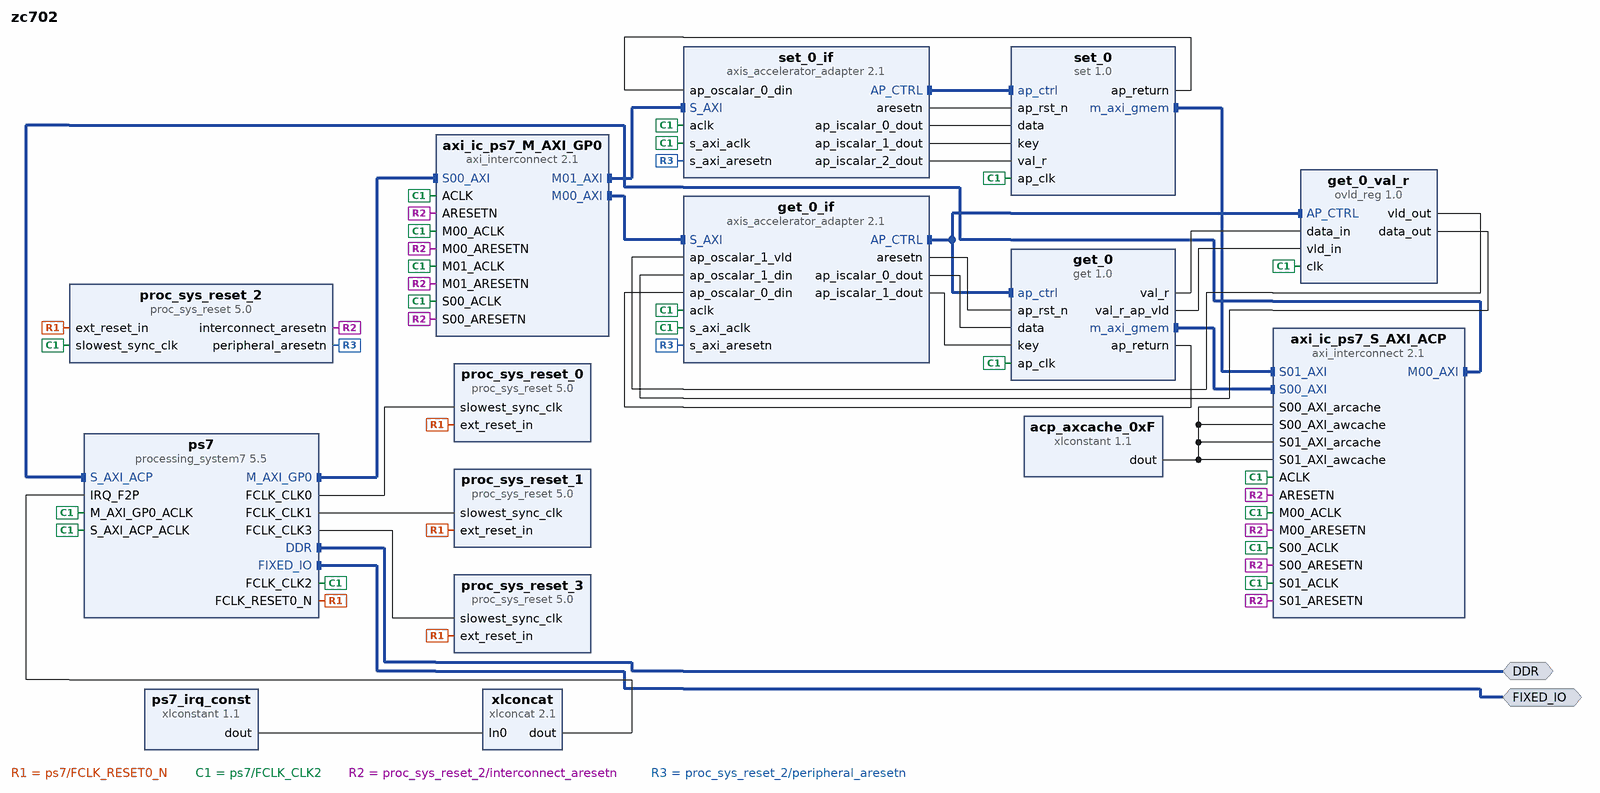
[diagram p0: block diagram of the top level]
# Vivado block design zc702, Vivado 2015.4
create_bd_design zc702

create_bd_intf_port -mode Master -vlnv xilinx.com:interface:ddrx_rtl:1.0 DDR
create_bd_intf_port -mode Master -vlnv xilinx.com:display_processing_system7:fixedio_rtl:1.0 FIXED_IO

create_bd_cell -type ip -vlnv xilinx.com:ip:proc_sys_reset:5.0 proc_sys_reset_1
set_property -dict {CONFIG.C_AUX_RESET_HIGH 0} [get_bd_cells proc_sys_reset_1]
create_bd_cell -type ip -vlnv xilinx.com:ip:proc_sys_reset:5.0 proc_sys_reset_2
set_property -dict {CONFIG.C_AUX_RESET_HIGH 0} [get_bd_cells proc_sys_reset_2]
create_bd_cell -type ip -vlnv xilinx.com:ip:proc_sys_reset:5.0 proc_sys_reset_3
set_property -dict {CONFIG.C_AUX_RESET_HIGH 0} [get_bd_cells proc_sys_reset_3]
create_bd_cell -type ip -vlnv xilinx.com:ip:proc_sys_reset:5.0 proc_sys_reset_0
set_property -dict {CONFIG.C_AUX_RESET_HIGH 0} [get_bd_cells proc_sys_reset_0]
create_bd_cell -type ip -vlnv xilinx.com:ip:processing_system7:5.5 ps7
set_property -dict [list \
  CONFIG.PCW_FCLK_CLK1_BUF true \
  CONFIG.PCW_FCLK_CLK2_BUF true \
  CONFIG.PCW_FCLK_CLK3_BUF true \
  CONFIG.PCW_UIPARAM_DDR_FREQ_MHZ 533.333333 \
  CONFIG.PCW_APU_PERIPHERAL_FREQMHZ 666.666666 \
  CONFIG.PCW_SDIO_PERIPHERAL_FREQMHZ 50 \
  CONFIG.PCW_UART_PERIPHERAL_FREQMHZ 50 \
  CONFIG.PCW_CAN_PERIPHERAL_FREQMHZ 23.8095 \
  CONFIG.PCW_I2C_PERIPHERAL_FREQMHZ 111.111115 \
  CONFIG.PCW_FPGA0_PERIPHERAL_FREQMHZ 166 \
  CONFIG.PCW_FPGA1_PERIPHERAL_FREQMHZ 142 \
  CONFIG.PCW_FPGA2_PERIPHERAL_FREQMHZ 100 \
  CONFIG.PCW_FPGA3_PERIPHERAL_FREQMHZ 200 \
  CONFIG.PCW_USE_S_AXI_ACP 1 \
  CONFIG.PCW_USE_FABRIC_INTERRUPT 1 \
  CONFIG.PCW_USE_DEFAULT_ACP_USER_VAL 1 \
  CONFIG.PCW_EN_CLK1_PORT 1 \
  CONFIG.PCW_EN_CLK2_PORT 1 \
  CONFIG.PCW_EN_CLK3_PORT 1 \
  CONFIG.PCW_IRQ_F2P_INTR 1 \
  CONFIG.PCW_PERIPHERAL_BOARD_PRESET part0 \
  CONFIG.PCW_PRESET_BANK0_VOLTAGE {LVCMOS 1.8V} \
  CONFIG.PCW_PRESET_BANK1_VOLTAGE {LVCMOS 1.8V} \
  CONFIG.PCW_UIPARAM_DDR_PARTNO {MT41J256M8 HX-15E} \
  CONFIG.PCW_QSPI_PERIPHERAL_ENABLE 1 \
  CONFIG.PCW_QSPI_QSPI_IO {MIO 1 .. 6} \
  CONFIG.PCW_QSPI_GRP_SINGLE_SS_ENABLE 1 \
  CONFIG.PCW_QSPI_GRP_SINGLE_SS_IO {MIO 1 .. 6} \
  CONFIG.PCW_QSPI_GRP_FBCLK_ENABLE 1 \
  CONFIG.PCW_QSPI_GRP_FBCLK_IO {MIO 8} \
  CONFIG.PCW_ENET0_PERIPHERAL_ENABLE 1 \
  CONFIG.PCW_ENET0_ENET0_IO {MIO 16 .. 27} \
  CONFIG.PCW_ENET0_GRP_MDIO_ENABLE 1 \
  CONFIG.PCW_ENET0_GRP_MDIO_IO {MIO 52 .. 53} \
  CONFIG.PCW_ENET0_RESET_ENABLE 1 \
  CONFIG.PCW_ENET0_RESET_IO {MIO 11} \
  CONFIG.PCW_SD0_PERIPHERAL_ENABLE 1 \
  CONFIG.PCW_SD0_SD0_IO {MIO 40 .. 45} \
  CONFIG.PCW_SD0_GRP_CD_ENABLE 1 \
  CONFIG.PCW_SD0_GRP_CD_IO {MIO 0} \
  CONFIG.PCW_SD0_GRP_WP_ENABLE 1 \
  CONFIG.PCW_SD0_GRP_WP_IO {MIO 15} \
  CONFIG.PCW_UART1_PERIPHERAL_ENABLE 1 \
  CONFIG.PCW_UART1_UART1_IO {MIO 48 .. 49} \
  CONFIG.PCW_CAN0_PERIPHERAL_ENABLE 1 \
  CONFIG.PCW_CAN0_CAN0_IO {MIO 46 .. 47} \
  CONFIG.PCW_USB0_PERIPHERAL_ENABLE 1 \
  CONFIG.PCW_USB0_USB0_IO {MIO 28 .. 39} \
  CONFIG.PCW_USB0_RESET_ENABLE 1 \
  CONFIG.PCW_USB0_RESET_IO {MIO 7} \
  CONFIG.PCW_I2C0_PERIPHERAL_ENABLE 1 \
  CONFIG.PCW_I2C0_I2C0_IO {MIO 50 .. 51} \
  CONFIG.PCW_I2C0_GRP_INT_ENABLE 0 \
  CONFIG.PCW_I2C0_RESET_ENABLE 1 \
  CONFIG.PCW_I2C0_RESET_IO {MIO 13} \
  CONFIG.PCW_GPIO_MIO_GPIO_ENABLE 1 \
  CONFIG.PCW_GPIO_MIO_GPIO_IO MIO \
  CONFIG.PCW_ENET0_PERIPHERAL_FREQMHZ {100 Mbps} \
  CONFIG.PCW_QSPI_PERIPHERAL_CLKSRC {ARM PLL} \
  CONFIG.PCW_TPIU_PERIPHERAL_CLKSRC {IO PLL} \
  CONFIG.PCW_DCI_PERIPHERAL_CLKSRC 1 \
  CONFIG.PCW_PCAP_PERIPHERAL_CLKSRC 1 \
  CONFIG.PCW_FPGA_FCLK1_ENABLE 1 \
  CONFIG.PCW_FPGA_FCLK2_ENABLE 1 \
  CONFIG.PCW_FPGA_FCLK3_ENABLE 1 \
] [get_bd_cells ps7]
# 353 more settings of ps7 are not shown: defaults, MIO pin electricals, DDR timing, and values the tool derives
create_bd_cell -type ip -vlnv xilinx.com:ip:xlconcat:2.1 xlconcat
set_property -dict {CONFIG.NUM_PORTS 1} [get_bd_cells xlconcat]
create_bd_cell -type ip -vlnv xilinx.com:hls:get:1.0 get_0
create_bd_cell -type ip -vlnv xilinx.com:hls:set:1.0 set_0
create_bd_cell -type ip -vlnv xilinx.com:ip:axis_accelerator_adapter:2.1 get_0_if
set_property -dict [list \
  CONFIG.C_N_OUTPUT_ARGS 0 \
  CONFIG.C_N_INPUT_ARGS 0 \
  CONFIG.C_N_INPUT_SCALARS 2 \
  CONFIG.C_N_OUTPUT_SCALARS 2 \
  CONFIG.C_INPUT_SCALAR_0_WIDTH 32 \
  CONFIG.C_INPUT_SCALAR_1_WIDTH 32 \
  CONFIG.C_OUTPUT_SCALAR_1_WIDTH 32 \
  CONFIG.C_OUTPUT_SCALAR_0_WIDTH 32 \
  CONFIG.C_OSCALAR_1_MODE AP_VLD \
] [get_bd_cells get_0_if]
create_bd_cell -type ip -vlnv xilinx.com:ip:ovld_reg:1.0 get_0_val_r
set_property -dict {CONFIG.DATA_WIDTH 32} [get_bd_cells get_0_val_r]
create_bd_cell -type ip -vlnv xilinx.com:ip:axis_accelerator_adapter:2.1 set_0_if
set_property -dict [list \
  CONFIG.C_N_OUTPUT_ARGS 0 \
  CONFIG.C_N_INPUT_ARGS 0 \
  CONFIG.C_N_INPUT_SCALARS 3 \
  CONFIG.C_N_OUTPUT_SCALARS 1 \
  CONFIG.C_INPUT_SCALAR_0_WIDTH 32 \
  CONFIG.C_INPUT_SCALAR_1_WIDTH 32 \
  CONFIG.C_INPUT_SCALAR_2_WIDTH 32 \
  CONFIG.C_OUTPUT_SCALAR_0_WIDTH 32 \
] [get_bd_cells set_0_if]
create_bd_cell -type ip -vlnv xilinx.com:ip:axi_interconnect:2.1 axi_ic_ps7_M_AXI_GP0
set_property -dict [list \
  CONFIG.NUM_SI 1 \
  CONFIG.NUM_MI 2 \
  CONFIG.STRATEGY 2 \
  CONFIG.M00_HAS_REGSLICE 1 \
  CONFIG.M01_HAS_REGSLICE 1 \
  CONFIG.S00_HAS_REGSLICE 1 \
] [get_bd_cells axi_ic_ps7_M_AXI_GP0]
create_bd_cell -type ip -vlnv xilinx.com:ip:axi_interconnect:2.1 axi_ic_ps7_S_AXI_ACP
set_property -dict [list \
  CONFIG.NUM_SI 2 \
  CONFIG.NUM_MI 1 \
  CONFIG.STRATEGY 2 \
  CONFIG.M00_HAS_REGSLICE 1 \
  CONFIG.M00_HAS_DATA_FIFO 2 \
  CONFIG.S00_HAS_REGSLICE 1 \
  CONFIG.S01_HAS_REGSLICE 1 \
  CONFIG.S00_HAS_DATA_FIFO 2 \
  CONFIG.S01_HAS_DATA_FIFO 2 \
] [get_bd_cells axi_ic_ps7_S_AXI_ACP]
create_bd_cell -type ip -vlnv xilinx.com:ip:xlconstant:1.1 ps7_irq_const
set_property -dict {CONFIG.CONST_WIDTH 1 CONFIG.CONST_VAL 0} [get_bd_cells ps7_irq_const]
create_bd_cell -type ip -vlnv xilinx.com:ip:xlconstant:1.1 acp_axcache_0xF
set_property -dict {CONFIG.CONST_WIDTH 4 CONFIG.CONST_VAL 15} [get_bd_cells acp_axcache_0xF]

# ---- connections ----

connect_bd_intf_net [get_bd_intf_pins get_0_if/AP_CTRL] [get_bd_intf_pins get_0/ap_ctrl]
connect_bd_intf_net [get_bd_intf_pins get_0_if/AP_CTRL] [get_bd_intf_pins get_0_val_r/AP_CTRL]
connect_bd_intf_net [get_bd_intf_pins set_0_if/AP_CTRL] [get_bd_intf_pins set_0/ap_ctrl]
connect_bd_intf_net [get_bd_intf_pins ps7/M_AXI_GP0] [get_bd_intf_pins axi_ic_ps7_M_AXI_GP0/S00_AXI]
connect_bd_intf_net [get_bd_intf_pins axi_ic_ps7_S_AXI_ACP/M00_AXI] [get_bd_intf_pins ps7/S_AXI_ACP]
connect_bd_intf_net [get_bd_intf_pins get_0/m_axi_gmem] [get_bd_intf_pins axi_ic_ps7_S_AXI_ACP/S00_AXI]
connect_bd_intf_net [get_bd_intf_pins set_0/m_axi_gmem] [get_bd_intf_pins axi_ic_ps7_S_AXI_ACP/S01_AXI]
connect_bd_intf_net [get_bd_intf_pins axi_ic_ps7_M_AXI_GP0/M00_AXI] [get_bd_intf_pins get_0_if/S_AXI]
connect_bd_intf_net [get_bd_intf_pins axi_ic_ps7_M_AXI_GP0/M01_AXI] [get_bd_intf_pins set_0_if/S_AXI]
connect_bd_intf_net [get_bd_intf_ports DDR] [get_bd_intf_pins ps7/DDR]
connect_bd_intf_net [get_bd_intf_ports FIXED_IO] [get_bd_intf_pins ps7/FIXED_IO]
connect_bd_net -net xlconcat_1_dout [get_bd_pins xlconcat/dout] [get_bd_pins ps7/IRQ_F2P]
connect_bd_net [get_bd_pins ps7/FCLK_RESET0_N] \
  [get_bd_pins proc_sys_reset_1/ext_reset_in] [get_bd_pins proc_sys_reset_2/ext_reset_in] \
  [get_bd_pins proc_sys_reset_3/ext_reset_in] [get_bd_pins proc_sys_reset_0/ext_reset_in]
connect_bd_net -net clkid3 [get_bd_pins ps7/FCLK_CLK3] [get_bd_pins proc_sys_reset_3/slowest_sync_clk]
connect_bd_net -net clkid2 [get_bd_pins ps7/FCLK_CLK2] \
  [get_bd_pins proc_sys_reset_2/slowest_sync_clk] [get_bd_pins ps7/M_AXI_GP0_ACLK] [get_bd_pins ps7/S_AXI_ACP_ACLK] \
  [get_bd_pins get_0/ap_clk] [get_bd_pins set_0/ap_clk] [get_bd_pins get_0_if/s_axi_aclk] [get_bd_pins get_0_if/aclk] \
  [get_bd_pins get_0_val_r/clk] [get_bd_pins set_0_if/s_axi_aclk] [get_bd_pins set_0_if/aclk] \
  [get_bd_pins axi_ic_ps7_M_AXI_GP0/ACLK] [get_bd_pins axi_ic_ps7_M_AXI_GP0/S00_ACLK] \
  [get_bd_pins axi_ic_ps7_M_AXI_GP0/M00_ACLK] [get_bd_pins axi_ic_ps7_M_AXI_GP0/M01_ACLK] \
  [get_bd_pins axi_ic_ps7_S_AXI_ACP/ACLK] [get_bd_pins axi_ic_ps7_S_AXI_ACP/M00_ACLK] \
  [get_bd_pins axi_ic_ps7_S_AXI_ACP/S00_ACLK] [get_bd_pins axi_ic_ps7_S_AXI_ACP/S01_ACLK]
connect_bd_net -net clkid1 [get_bd_pins ps7/FCLK_CLK1] [get_bd_pins proc_sys_reset_1/slowest_sync_clk]
connect_bd_net -net clkid0 [get_bd_pins ps7/FCLK_CLK0] [get_bd_pins proc_sys_reset_0/slowest_sync_clk]
connect_bd_net [get_bd_pins get_0_if/aresetn] [get_bd_pins get_0/ap_rst_n]
connect_bd_net [get_bd_pins get_0/ap_return] [get_bd_pins get_0_if/ap_oscalar_0_din]
connect_bd_net [get_bd_pins get_0_if/ap_iscalar_0_dout] [get_bd_pins get_0/data]
connect_bd_net [get_bd_pins get_0_if/ap_iscalar_1_dout] [get_bd_pins get_0/key]
connect_bd_net [get_bd_pins get_0/val_r] [get_bd_pins get_0_val_r/data_in]
connect_bd_net [get_bd_pins get_0/val_r_ap_vld] [get_bd_pins get_0_val_r/vld_in]
connect_bd_net [get_bd_pins get_0_val_r/vld_out] [get_bd_pins get_0_if/ap_oscalar_1_vld]
connect_bd_net [get_bd_pins get_0_val_r/data_out] [get_bd_pins get_0_if/ap_oscalar_1_din]
connect_bd_net [get_bd_pins set_0_if/aresetn] [get_bd_pins set_0/ap_rst_n]
connect_bd_net [get_bd_pins set_0/ap_return] [get_bd_pins set_0_if/ap_oscalar_0_din]
connect_bd_net [get_bd_pins set_0_if/ap_iscalar_0_dout] [get_bd_pins set_0/data]
connect_bd_net [get_bd_pins set_0_if/ap_iscalar_1_dout] [get_bd_pins set_0/key]
connect_bd_net [get_bd_pins set_0_if/ap_iscalar_2_dout] [get_bd_pins set_0/val_r]
connect_bd_net [get_bd_pins proc_sys_reset_2/interconnect_aresetn] \
  [get_bd_pins axi_ic_ps7_M_AXI_GP0/ARESETN] [get_bd_pins axi_ic_ps7_M_AXI_GP0/S00_ARESETN] \
  [get_bd_pins axi_ic_ps7_M_AXI_GP0/M00_ARESETN] [get_bd_pins axi_ic_ps7_M_AXI_GP0/M01_ARESETN] \
  [get_bd_pins axi_ic_ps7_S_AXI_ACP/ARESETN] [get_bd_pins axi_ic_ps7_S_AXI_ACP/M00_ARESETN] \
  [get_bd_pins axi_ic_ps7_S_AXI_ACP/S00_ARESETN] [get_bd_pins axi_ic_ps7_S_AXI_ACP/S01_ARESETN]
connect_bd_net [get_bd_pins proc_sys_reset_2/peripheral_aresetn] [get_bd_pins get_0_if/s_axi_aresetn] [get_bd_pins set_0_if/s_axi_aresetn]
connect_bd_net [get_bd_pins ps7_irq_const/dout] [get_bd_pins xlconcat/In0]
connect_bd_net [get_bd_pins acp_axcache_0xF/dout] \
  [get_bd_pins axi_ic_ps7_S_AXI_ACP/S00_AXI_arcache] [get_bd_pins axi_ic_ps7_S_AXI_ACP/S00_AXI_awcache] \
  [get_bd_pins axi_ic_ps7_S_AXI_ACP/S01_AXI_arcache] [get_bd_pins axi_ic_ps7_S_AXI_ACP/S01_AXI_awcache]

# ---- address map ----
assign_bd_address -offset 0x00000000 -range 1G -target_address_space [get_bd_addr_spaces get_0/Data_m_axi_gmem] [get_bd_addr_segs ps7/S_AXI_ACP/ACP_DDR_LOWOCM]
assign_bd_address -offset 0x40000000 -range 1G -target_address_space [get_bd_addr_spaces get_0/Data_m_axi_gmem] [get_bd_addr_segs ps7/S_AXI_ACP/ACP_M_AXI_GP0]
assign_bd_address -offset 0xE0000000 -range 4M -target_address_space [get_bd_addr_spaces get_0/Data_m_axi_gmem] [get_bd_addr_segs ps7/S_AXI_ACP/ACP_IOP]
assign_bd_address -offset 0xFC000000 -range 16M -target_address_space [get_bd_addr_spaces get_0/Data_m_axi_gmem] [get_bd_addr_segs ps7/S_AXI_ACP/ACP_QSPI_LINEAR]
assign_bd_address -offset 0x43C00000 -range 64K -target_address_space [get_bd_addr_spaces ps7/Data] [get_bd_addr_segs get_0_if/S_AXI/Reg]
assign_bd_address -offset 0x43C10000 -range 64K -target_address_space [get_bd_addr_spaces ps7/Data] [get_bd_addr_segs set_0_if/S_AXI/Reg]
assign_bd_address -offset 0x00000000 -range 1G -target_address_space [get_bd_addr_spaces set_0/Data_m_axi_gmem] [get_bd_addr_segs ps7/S_AXI_ACP/ACP_DDR_LOWOCM]
assign_bd_address -offset 0x40000000 -range 1G -target_address_space [get_bd_addr_spaces set_0/Data_m_axi_gmem] [get_bd_addr_segs ps7/S_AXI_ACP/ACP_M_AXI_GP0]
assign_bd_address -offset 0xE0000000 -range 4M -target_address_space [get_bd_addr_spaces set_0/Data_m_axi_gmem] [get_bd_addr_segs ps7/S_AXI_ACP/ACP_IOP]
assign_bd_address -offset 0xFC000000 -range 16M -target_address_space [get_bd_addr_spaces set_0/Data_m_axi_gmem] [get_bd_addr_segs ps7/S_AXI_ACP/ACP_QSPI_LINEAR]

validate_bd_design
save_bd_design
